# EAGLE design screwshield-digital-v1 (EAGLE 5.05)
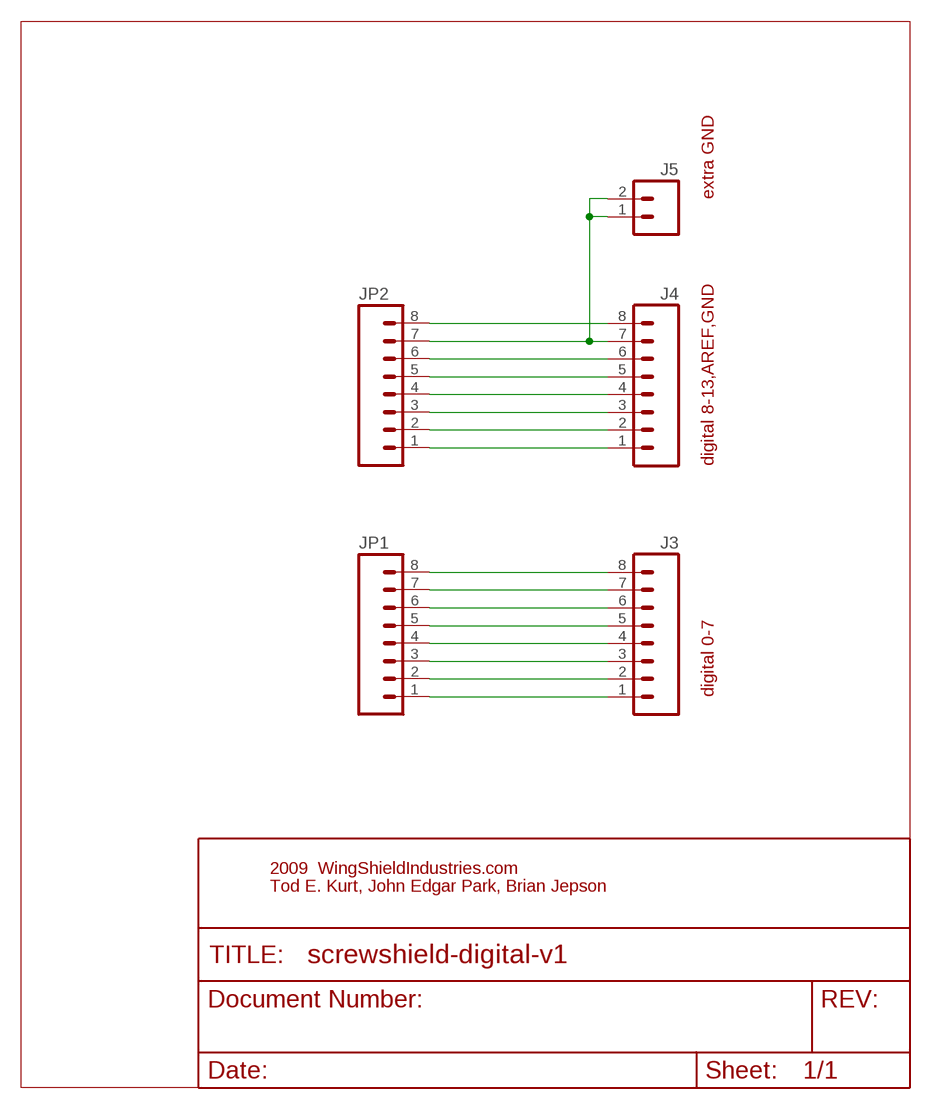
[diagram p0: schematic, sheet 1]

## Parts
J3  M08-SCREWTERMINAL  [SCREWTERMINAL-3.5MM-8]
J4  M08-SCREWTERMINAL  [SCREWTERMINAL-3.5MM-8]
J5  M023.5MM  [SCREWTERMINAL-3.5MM-2]
JP1  M08LOCK_LONGPADS  [1X08_LOCK_LONGPADS]
JP2  M08LOCK_LONGPADS  [1X08_LOCK_LONGPADS]

## Nets
GND: J4.7 J5.1 J5.2 JP2.7
N$1: J4.8 JP2.8
N$3: J4.6 JP2.6
N$4: J4.5 JP2.5
N$5: J4.4 JP2.4
N$6: J4.3 JP2.3
N$7: J4.2 JP2.2
N$8: J4.1 JP2.1
N$9: J3.8 JP1.8
N$10: J3.7 JP1.7
N$11: J3.6 JP1.6
N$12: J3.4 JP1.4
N$13: J3.5 JP1.5
N$14: J3.3 JP1.3
N$15: J3.2 JP1.2
N$16: J3.1 JP1.1

## Notes on the sheet
- extra GND
- digital 8-13,AREF,GND
- digital 0-7
- 2009  WingShieldIndustries.com
- Tod E. Kurt, John Edgar Park, Brian Jepson

## Library data of the parts
J3 J4 = todstuff:M08-SCREWTERMINAL
J5 = SparkFun-20090108:M02: Header 2 Standard 2-pin 0.1" header. Use with straight break away headers (SKU : PRT-00116), right angle break away headers (PRT-00553), swiss pins (PRT-00743), machine pins (PRT-00117), and female headers (PRT-00115). Molex polarized connector foot print use with SKU : PRT-08233 with associated crimp pins and housings.
JP1 JP2 = SparkFun-20090108:M08: Header 8 Standard 8-pin 0.1" header. Use with straight break away headers (SKU : PRT-00116), right angle break away headers (PRT-00553), swiss pins (PRT-00743), machine pins (PRT-00117), and female headers (PRT-00115).

## Board
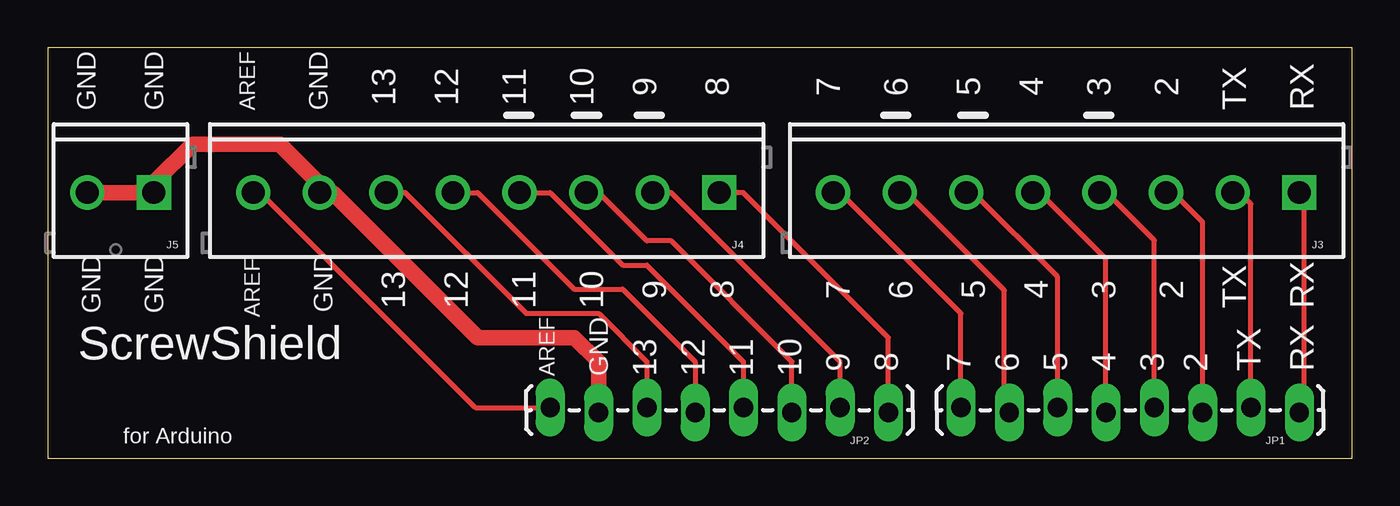
[diagram p1: board, top side]
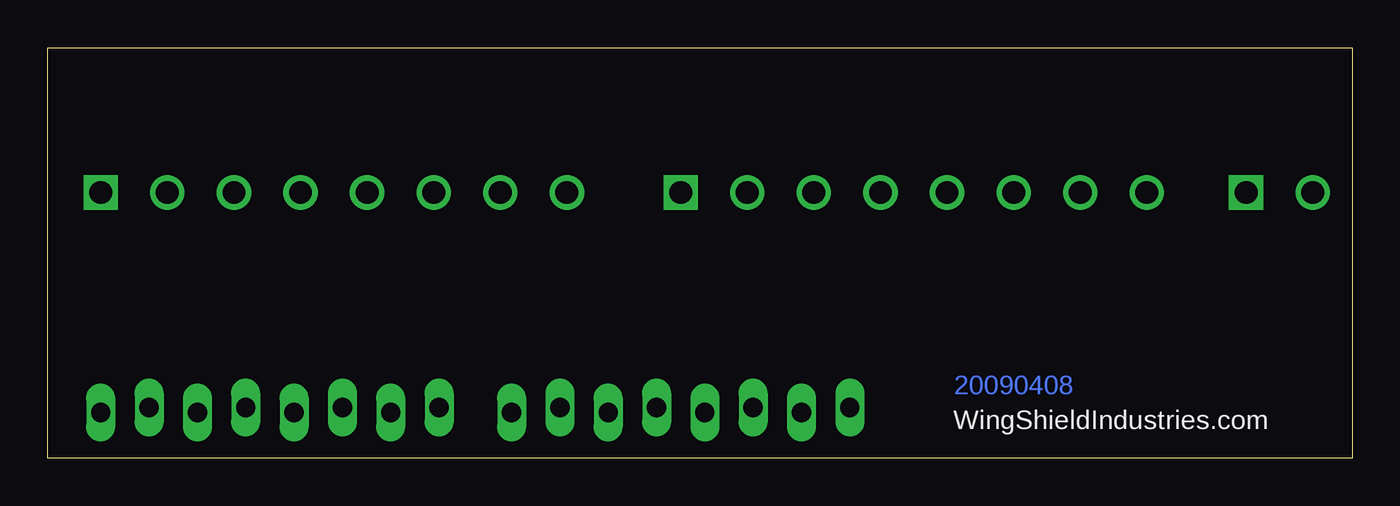
[diagram p2: board, bottom side, seen from below]

Size 68.58 x 21.59 mm. Coordinates in mm from the lower left corner, seen from the top.
Outline: 0,0 68.58,0 68.58,21.59 0,21.59 0,0
Copper layers (1*16): Top 0.035mm / dielectric 1.5mm / Bottom 0.035mm
Design rules "default": minimum track width 10mil, minimum drill 24mil, track to track 8mil, track to pad 8mil, pad to pad 8mil, via to via 8mil, smd to smd 8mil, copper to edge 40mil, drill to drill 8mil, minimum pad ring 10mil, minimum via ring 8mil, stop-mask expansion 4mil, vias tented up to drill 0mil, thermal gap 10mil

### Footprints (pad centres in the part's own frame; a part is rotated, then mirrored left to right if it is on the bottom)
SCREWTERMINAL-3.5MM-8 = drill 1.2 square: 1 0,0 | drill 1.2 round: 2 3.5,0; 3 7,0; 4 10.5,0; 5 14,0; 6 17.5,0; 7 21,0; 8 24.5,0
SCREWTERMINAL-3.5MM-2 = drill 1.2 square: 1 0,0 | drill 1.2 round: 2 3.5,0
1X08_LOCK_LONGPADS = drill 1.016 long: 1 0,0.127; 2 2.54,-0.127; 3 5.08,0.127; 4 7.62,-0.127; 5 10.16,0.127; 6 12.7,-0.127; 7 15.24,0.127; 8 17.78,-0.127

### Placement (x,y rotation side)
J3  65.79,13.97 180 top
J4  35.31,13.97 180 top
J5  5.59,13.97 180 top
JP1  65.79,2.54 180 top
JP2  44.2,2.54 180 top

### Tracks (layer width: path | path; a pad name or v marks a point on that pad's centre or on a via)
GND
  Top 0.254: 14.22,14.48 14.31,14.4
  Top 0.813: 14.22,14.48 12.7,16 12.19,16.51 7.62,16.51 5.59,14.48 J5.1 J5.2 | 14.31,14.4 J4.7 14.99,13.97 22.61,6.35 27.69,6.35 28.96,5.08 JP2.7
N$1
  Top 0.254: JP2.8 22.48,2.67 11.18,13.97 J4.8
N$3
  Top 0.254: JP2.6 31.5,5.08 28.96,7.62 25.15,7.62 18.8,13.97 J4.6
N$4
  Top 0.254: JP2.5 34.04,5.08 30.23,8.89 27.69,8.89 22.61,13.97 J4.5
N$5
  Top 0.254: JP2.4 36.58,5.08 31.5,10.16 30.23,10.16 26.42,13.97 J4.4
N$6
  Top 0.254: JP2.3 39.12,5.08 32.77,11.43 31.5,11.43 28.96,13.97 J4.3
N$7
  Top 0.254: JP2.2 41.66,5.08 32.77,13.97 J4.2
N$8
  Top 0.254: JP2.1 44.2,6.35 36.58,13.97 J4.1
N$9
  Top 0.254: JP1.8 48.01,7.62 41.66,13.97 J3.8
N$10
  Top 0.254: JP1.7 50.29,3.81 50.29,8.83 45.16,13.97 J3.7
N$11
  Top 0.254: JP1.6 53.09,9.54 48.66,13.97 J3.6
N$12
  Top 0.254: JP1.4 58.17,11.46 55.66,13.97 J3.4
N$13
  Top 0.254: JP1.5 55.63,10.5 52.16,13.97 J3.5
N$14
  Top 0.254: JP1.3 60.71,12.42 59.16,13.97 J3.3
N$15
  Top 0.254: JP1.2 63.25,13.38 62.66,13.97 J3.2
N$16
  Top 0.254: JP1.1 66.04,3.81 66.04,13.21 65.79,13.46 J3.1

### Text on the board
Bottom: 20090408
tPlace: 13 | 12 | 11 | 10 | 9 | 8 | 7 | 6 | 5 | 4 | 3 | 2 | GND | GND | AREF | GND | TX | RX | GND | GND | GND | 13 | 12 | 11 | 10 | 9 | 8 | 7 | 6 | 5 | 4 | 3 | 2 | TX | RX | AREF | ScrewShield | 9 | 8 | 7 | 6 | 5 | 4 | 3 | 2 | TX | RX | AREF | GND | 13 | 12 | 11 | 10 | for Arduino
bPlace: WingShieldIndustries.com